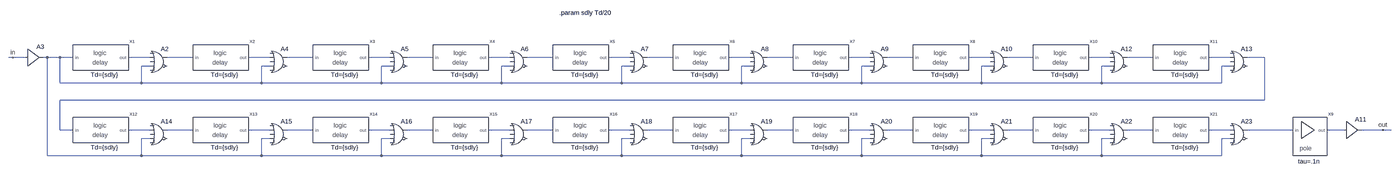
[diagram p0: schematic stretcher_20.asc, whole sheet]
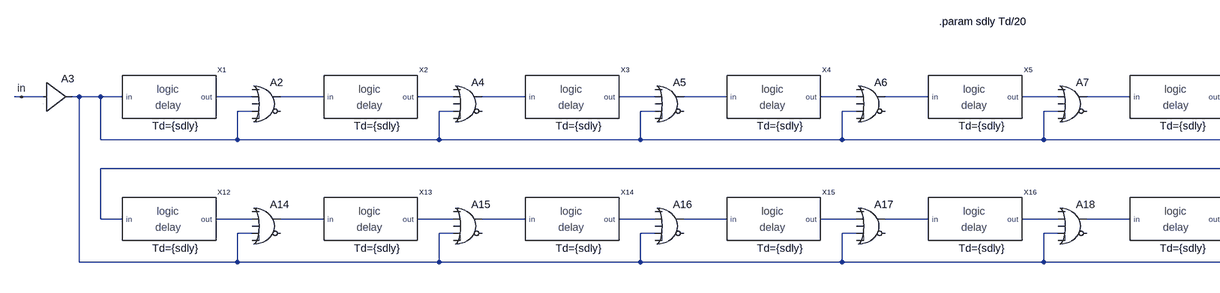
[diagram p1: schematic stretcher_20.asc, part, row 1 of 1, column 1 of 2]
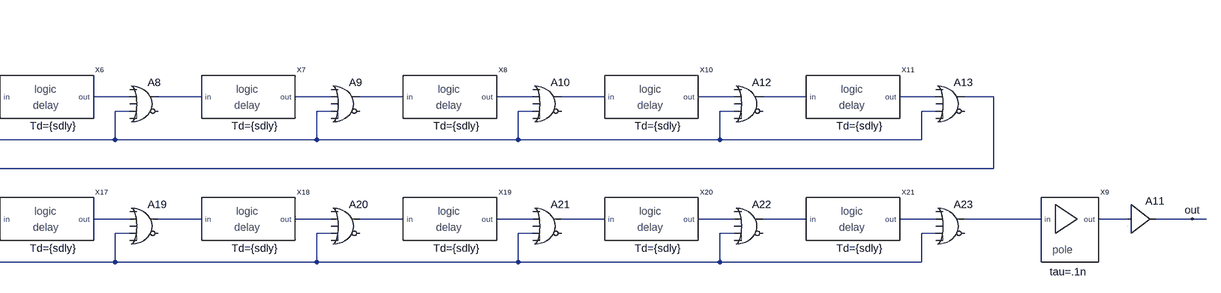
[diagram p2: schematic stretcher_20.asc, part, row 1 of 1, column 2 of 2]
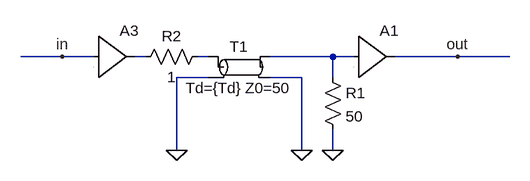
[diagram p3: sub-circuit logic_delay.asc]
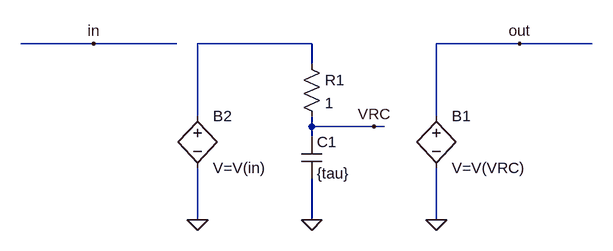
[diagram p4: sub-circuit ideal_pole.asc]
stretcher_20.asc, the LTspice schematic file:
Version 4
SHEET 1 4048 680
WIRE -1184 -320 -1200 -320
WIRE -1136 -320 -1184 -320
WIRE -1056 -320 -1072 -320
WIRE -1008 -320 -1056 -320
WIRE -960 -320 -1008 -320
WIRE -672 -320 -752 -320
WIRE -512 -320 -608 -320
WIRE -224 -320 -304 -320
WIRE -64 -320 -160 -320
WIRE 224 -320 144 -320
WIRE 384 -320 288 -320
WIRE 672 -320 592 -320
WIRE 832 -320 736 -320
WIRE 1120 -320 1040 -320
WIRE 1280 -320 1184 -320
WIRE 1568 -320 1488 -320
WIRE 1728 -320 1632 -320
WIRE 2016 -320 1936 -320
WIRE 2176 -320 2080 -320
WIRE 2464 -320 2384 -320
WIRE 2624 -320 2528 -320
WIRE 2912 -320 2832 -320
WIRE 3072 -320 2976 -320
WIRE 3360 -320 3280 -320
WIRE 3488 -320 3424 -320
WIRE -672 -288 -704 -288
WIRE -224 -288 -256 -288
WIRE 224 -288 192 -288
WIRE 672 -288 640 -288
WIRE 1120 -288 1088 -288
WIRE 1568 -288 1536 -288
WIRE 2016 -288 1984 -288
WIRE 2464 -288 2432 -288
WIRE 2912 -288 2880 -288
WIRE 3360 -288 3328 -288
WIRE -1008 -224 -1008 -320
WIRE -704 -224 -704 -288
WIRE -704 -224 -1008 -224
WIRE -256 -224 -256 -288
WIRE -256 -224 -704 -224
WIRE 192 -224 192 -288
WIRE 192 -224 -256 -224
WIRE 640 -224 640 -288
WIRE 640 -224 192 -224
WIRE 1088 -224 1088 -288
WIRE 1088 -224 640 -224
WIRE 1536 -224 1536 -288
WIRE 1536 -224 1088 -224
WIRE 1984 -224 1984 -288
WIRE 1984 -224 1536 -224
WIRE 2432 -224 2432 -288
WIRE 2432 -224 1984 -224
WIRE 2880 -224 2880 -288
WIRE 2880 -224 2432 -224
WIRE 3328 -224 3328 -288
WIRE 3328 -224 2880 -224
WIRE 3488 -160 3488 -320
WIRE 3488 -160 -1008 -160
WIRE -1008 -48 -1008 -160
WIRE -960 -48 -1008 -48
WIRE -672 -48 -752 -48
WIRE -512 -48 -608 -48
WIRE -224 -48 -304 -48
WIRE -64 -48 -160 -48
WIRE 224 -48 144 -48
WIRE 384 -48 288 -48
WIRE 672 -48 592 -48
WIRE 832 -48 736 -48
WIRE 1120 -48 1040 -48
WIRE 1280 -48 1184 -48
WIRE 1568 -48 1488 -48
WIRE 1728 -48 1632 -48
WIRE 2016 -48 1936 -48
WIRE 2176 -48 2080 -48
WIRE 2464 -48 2384 -48
WIRE 2624 -48 2528 -48
WIRE 2912 -48 2832 -48
WIRE 3072 -48 2976 -48
WIRE 3360 -48 3280 -48
WIRE 3664 -48 3424 -48
WIRE 3856 -48 3792 -48
WIRE 4000 -48 3920 -48
WIRE 4032 -48 4000 -48
WIRE -672 -16 -704 -16
WIRE -224 -16 -256 -16
WIRE 224 -16 192 -16
WIRE 672 -16 640 -16
WIRE 1120 -16 1088 -16
WIRE 1568 -16 1536 -16
WIRE 2016 -16 1984 -16
WIRE 2464 -16 2432 -16
WIRE 2912 -16 2880 -16
WIRE 3360 -16 3328 -16
WIRE -1056 48 -1056 -320
WIRE -704 48 -704 -16
WIRE -704 48 -1056 48
WIRE -256 48 -256 -16
WIRE -256 48 -704 48
WIRE 192 48 192 -16
WIRE 192 48 -256 48
WIRE 640 48 640 -16
WIRE 640 48 192 48
WIRE 1088 48 1088 -16
WIRE 1088 48 640 48
WIRE 1536 48 1536 -16
WIRE 1536 48 1088 48
WIRE 1984 48 1984 -16
WIRE 1984 48 1536 48
WIRE 2432 48 2432 -16
WIRE 2432 48 1984 48
WIRE 2880 48 2880 -16
WIRE 2880 48 2432 48
WIRE 3328 48 3328 -16
WIRE 3328 48 2880 48
FLAG -1184 -320 in
FLAG 4000 -48 out
SYMBOL Digital\\buf1 -1136 -384 R0
SYMATTR InstName A3
SYMBOL logic_delay -864 -320 R0
SYMATTR InstName X1
SYMATTR SpiceLine Td={sdly}
SYMBOL Digital\\or -640 -368 R0
SYMATTR InstName A2
SYMBOL logic_delay -416 -320 R0
SYMATTR InstName X2
SYMATTR SpiceLine Td={sdly}
SYMBOL Digital\\or -192 -368 R0
SYMATTR InstName A4
SYMBOL logic_delay 32 -320 R0
SYMATTR InstName X3
SYMATTR SpiceLine Td={sdly}
SYMBOL Digital\\or 256 -368 R0
SYMATTR InstName A5
SYMBOL logic_delay 480 -320 R0
SYMATTR InstName X4
SYMATTR SpiceLine Td={sdly}
SYMBOL Digital\\or 704 -368 R0
SYMATTR InstName A6
SYMBOL logic_delay 928 -320 R0
SYMATTR InstName X5
SYMATTR SpiceLine Td={sdly}
SYMBOL Digital\\or 1152 -368 R0
SYMATTR InstName A7
SYMBOL logic_delay 1376 -320 R0
SYMATTR InstName X6
SYMATTR SpiceLine Td={sdly}
SYMBOL Digital\\or 1600 -368 R0
SYMATTR InstName A8
SYMBOL logic_delay 1824 -320 R0
SYMATTR InstName X7
SYMATTR SpiceLine Td={sdly}
SYMBOL Digital\\or 2048 -368 R0
SYMATTR InstName A9
SYMBOL logic_delay 2272 -320 R0
SYMATTR InstName X8
SYMATTR SpiceLine Td={sdly}
SYMBOL Digital\\or 2496 -368 R0
SYMATTR InstName A10
SYMBOL ideal_pole 3728 -48 R0
SYMATTR SpiceLine tau=.1n
SYMATTR InstName X9
SYMBOL Digital\\buf1 3856 -112 R0
SYMATTR InstName A11
SYMBOL logic_delay 2720 -320 R0
SYMATTR InstName X10
SYMATTR SpiceLine Td={sdly}
SYMBOL Digital\\or 2944 -368 R0
SYMATTR InstName A12
SYMBOL logic_delay 3168 -320 R0
SYMATTR InstName X11
SYMATTR SpiceLine Td={sdly}
SYMBOL Digital\\or 3392 -368 R0
SYMATTR InstName A13
SYMBOL logic_delay -864 -48 R0
SYMATTR InstName X12
SYMATTR SpiceLine Td={sdly}
SYMBOL Digital\\or -640 -96 R0
SYMATTR InstName A14
SYMBOL logic_delay -416 -48 R0
SYMATTR InstName X13
SYMATTR SpiceLine Td={sdly}
SYMBOL Digital\\or -192 -96 R0
SYMATTR InstName A15
SYMBOL logic_delay 32 -48 R0
SYMATTR InstName X14
SYMATTR SpiceLine Td={sdly}
SYMBOL Digital\\or 256 -96 R0
SYMATTR InstName A16
SYMBOL logic_delay 480 -48 R0
SYMATTR InstName X15
SYMATTR SpiceLine Td={sdly}
SYMBOL Digital\\or 704 -96 R0
SYMATTR InstName A17
SYMBOL logic_delay 928 -48 R0
SYMATTR InstName X16
SYMATTR SpiceLine Td={sdly}
SYMBOL Digital\\or 1152 -96 R0
SYMATTR InstName A18
SYMBOL logic_delay 1376 -48 R0
SYMATTR InstName X17
SYMATTR SpiceLine Td={sdly}
SYMBOL Digital\\or 1600 -96 R0
SYMATTR InstName A19
SYMBOL logic_delay 1824 -48 R0
SYMATTR InstName X18
SYMATTR SpiceLine Td={sdly}
SYMBOL Digital\\or 2048 -96 R0
SYMATTR InstName A20
SYMBOL logic_delay 2272 -48 R0
SYMATTR InstName X19
SYMATTR SpiceLine Td={sdly}
SYMBOL Digital\\or 2496 -96 R0
SYMATTR InstName A21
SYMBOL logic_delay 2720 -48 R0
SYMATTR InstName X20
SYMATTR SpiceLine Td={sdly}
SYMBOL Digital\\or 2944 -96 R0
SYMATTR InstName A22
SYMBOL logic_delay 3168 -48 R0
SYMATTR InstName X21
SYMATTR SpiceLine Td={sdly}
SYMBOL Digital\\or 3392 -96 R0
SYMATTR InstName A23
TEXT 856 -488 Left 2 !.param sdly Td/20

logic_delay.asc, the sub-circuit schematic file:
Version 4
SHEET 1 880 680
WIRE 32 192 -32 192
WIRE 80 192 32 192
WIRE 160 192 144 192
WIRE 256 192 240 192
WIRE 448 192 352 192
WIRE 480 192 448 192
WIRE 640 192 544 192
WIRE 720 192 640 192
WIRE 256 224 208 224
WIRE 400 224 352 224
WIRE 448 224 448 192
WIRE 208 336 208 224
WIRE 400 336 400 224
WIRE 448 336 448 304
FLAG 32 192 in
FLAG 640 192 out
FLAG 400 336 0
FLAG 208 336 0
FLAG 448 336 0
SYMBOL Digital\\buf1 80 128 R0
SYMATTR InstName A3
SYMBOL Digital\\buf1 480 128 R0
SYMATTR InstName A1
SYMBOL res 432 208 R0
SYMATTR InstName R1
SYMATTR Value 50
SYMBOL tline 304 208 R0
SYMATTR InstName T1
SYMATTR Value Td={Td} Z0=50
SYMBOL res 256 176 R90
WINDOW 0 0 56 VBottom 2
WINDOW 3 32 56 VTop 2
SYMATTR InstName R2
SYMATTR Value 1

ideal_pole.asc, the sub-circuit schematic file:
Version 4
SHEET 1 2652 680
WIRE 528 32 416 32
WIRE 656 32 528 32
WIRE 864 32 688 32
WIRE 1184 32 1056 32
WIRE 1296 32 1184 32
WIRE 864 64 864 32
WIRE 688 144 688 32
WIRE 1056 144 1056 32
WIRE 864 160 864 144
WIRE 960 160 864 160
WIRE 976 160 960 160
WIRE 864 176 864 160
WIRE 688 304 688 224
WIRE 864 304 864 240
WIRE 1056 304 1056 224
FLAG 688 304 0
FLAG 528 32 in
FLAG 1056 304 0
FLAG 1184 32 out
FLAG 864 304 0
FLAG 960 160 VRC
SYMBOL bv 688 128 R0
SYMATTR InstName B2
SYMATTR Value V=V(in)
SYMBOL bv 1056 128 R0
SYMATTR InstName B1
SYMATTR Value V=V(VRC)
SYMBOL res 848 48 R0
SYMATTR InstName R1
SYMATTR Value 1
SYMBOL cap 848 176 R0
SYMATTR InstName C1
SYMATTR Value {tau}

The netlist it stands for:
* stretcher_20.asc
A3 in 0 0 0 0 0 N001 0 BUF
XX1 N001 N002 logic_delay params: Td={sdly}
A2 0 N002 0 N001 0 0 N003 0 OR
XX2 N003 N004 logic_delay params: Td={sdly}
A4 0 N004 0 N001 0 0 N005 0 OR
XX3 N005 N006 logic_delay params: Td={sdly}
A5 0 N006 0 N001 0 0 N007 0 OR
XX4 N007 N008 logic_delay params: Td={sdly}
A6 0 N008 0 N001 0 0 N009 0 OR
XX5 N009 N010 logic_delay params: Td={sdly}
A7 0 N010 0 N001 0 0 N011 0 OR
XX6 N011 N012 logic_delay params: Td={sdly}
A8 0 N012 0 N001 0 0 N013 0 OR
XX7 N013 N014 logic_delay params: Td={sdly}
A9 0 N014 0 N001 0 0 N015 0 OR
XX8 N015 N016 logic_delay params: Td={sdly}
A10 0 N016 0 N001 0 0 N017 0 OR
XX9 N041 N042 ideal_pole params: tau=.1n
A11 N042 0 0 0 0 0 out 0 BUF
XX10 N017 N018 logic_delay params: Td={sdly}
A12 0 N018 0 N001 0 0 N019 0 OR
XX11 N019 N020 logic_delay params: Td={sdly}
A13 0 N020 0 N001 0 0 N021 0 OR
XX12 N021 N022 logic_delay params: Td={sdly}
A14 0 N022 0 N001 0 0 N023 0 OR
XX13 N023 N024 logic_delay params: Td={sdly}
A15 0 N024 0 N001 0 0 N025 0 OR
XX14 N025 N026 logic_delay params: Td={sdly}
A16 0 N026 0 N001 0 0 N027 0 OR
XX15 N027 N028 logic_delay params: Td={sdly}
A17 0 N028 0 N001 0 0 N029 0 OR
XX16 N029 N030 logic_delay params: Td={sdly}
A18 0 N030 0 N001 0 0 N031 0 OR
XX17 N031 N032 logic_delay params: Td={sdly}
A19 0 N032 0 N001 0 0 N033 0 OR
XX18 N033 N034 logic_delay params: Td={sdly}
A20 0 N034 0 N001 0 0 N035 0 OR
XX19 N035 N036 logic_delay params: Td={sdly}
A21 0 N036 0 N001 0 0 N037 0 OR
XX20 N037 N038 logic_delay params: Td={sdly}
A22 0 N038 0 N001 0 0 N039 0 OR
XX21 N039 N040 logic_delay params: Td={sdly}
A23 0 N040 0 N001 0 0 N041 0 OR

* block symbol definitions
.subckt logic_delay in out
A3 in 0 0 0 0 0 N001 0 BUF
A1 N003 0 0 0 0 0 out 0 BUF
R1 N003 0 50
T1 N002 0 N003 0 Td={Td} Z0=50
R2 N002 N001 1
.ends logic_delay

.subckt ideal_pole in out
B2 N001 0 V=V(in)
B1 out 0 V=V(VRC)
R1 N001 VRC 1
C1 VRC 0 {tau}
.ends ideal_pole

.param sdly Td/20
.backanno
.end